# EAGLE design main (EAGLE 5.08)
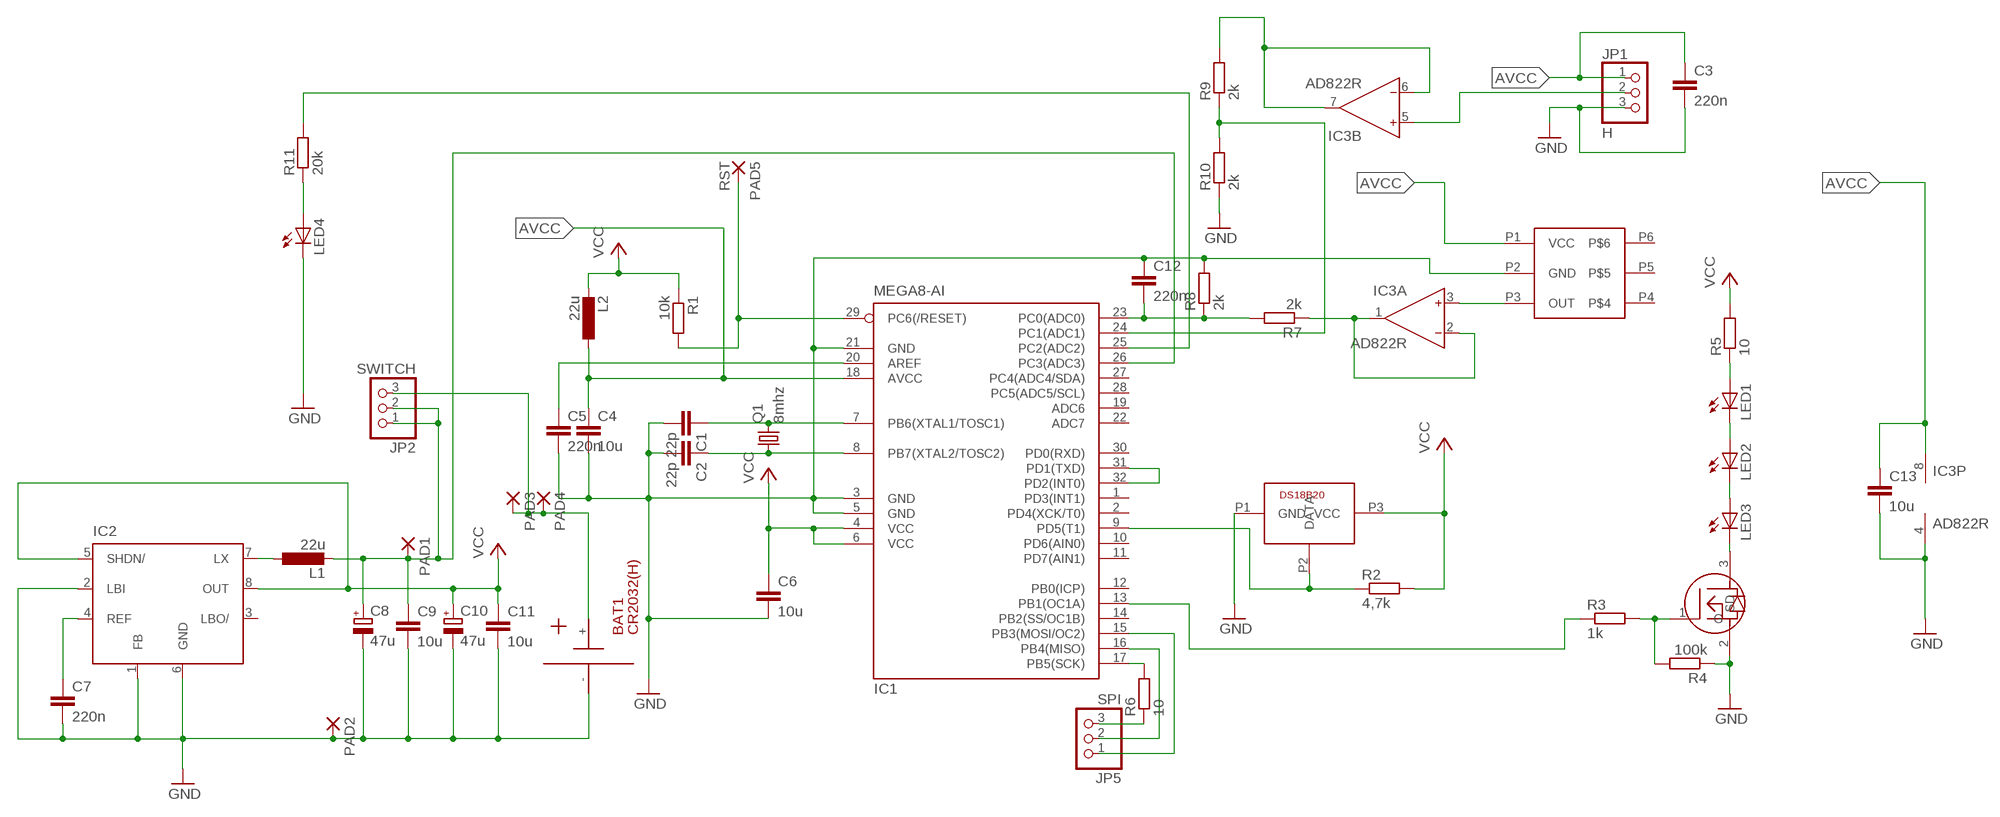
[diagram p0: schematic, sheet 1]

## Parts
BAT1  CR2032(H)  [BEL/P]
C1  22p  C-EUC0805  [C0805]
C2  22p  C-EUC0805  [C0805]
C3  220n  C-EUC1206  [C1206]
C4  10u  C-EUC0805  [C0805]
C5  220n  C-EUC0805  [C0805]
C6  10u  C-EUC0805  [C0805]
C7  220n  C-EUC0805  [C0805]
C8  47u  CPOL-EUE2.5-5  [E2,5-5]
C9  10u  C-EUC0805  [C0805]
C10  47u  CPOL-EUE2.5-5  [E2,5-5]
C11  10u  C-EUC0805  [C0805]
C12  220n  C-EUC0805  [C0805]
C13  10u  C-EUC0805  [C0805]
IC1  MEGA8-AI  [TQFP32-08]
IC2  MAX1674  [UMAX8]
IC3  AD822R  [SO8]
JP1  H  PINHD-1X3  [1X03]
JP2  SWITCH  PINHD-1X3  [1X03]
JP5  SPI  PINHD-1X3  [1X03]
L1  22u  L-EUL1812  [L1812]
L2  22u  L-EUL1812  [L1812]
LED1  LED5MM  [LED5MM]
LED2  LED5MM  [LED5MM]
LED3  LED5MM  [LED5MM]
LED4  LED5MM  [LED5MM]
PAD1  2,54/0,8  [2,54/0,8]
PAD2  2,54/0,8  [2,54/0,8]
PAD3  2,54/0,8  [2,54/0,8]
PAD4  2,54/0,8  [2,54/0,8]
PAD5  RST  2,54/0,8  [2,54/0,8]
Q1  8mhz  CRYSTALHC49S  [HC49/S]
R1  10k  R-EU_M1206  [M1206]
R2  4,7k  R-EU_M0805  [M0805]
R3  1k  R-EU_M1206  [M1206]
R4  100k  R-EU_M1206  [M1206]
R5  10  R-EU_M1206  [M1206]
R6  10  R-EU_M1206  [M1206]
R7  2k  R-EU_M1206  [M1206]
R8  2k  R-EU_M0805  [M0805]
R9  2k  R-EU_M1206  [M1206]
R10  2k  R-EU_M1206  [M1206]
R11  20k  R-EU_M0805  [M0805]
U$1  DS18B20  [TO-92]
U$2  IRLML2803  [MICRO3]
U$3  40PC  [40PC]

## Nets
AVCC: C3.1 C4.1 C13.1 IC1.18(AVCC) IC3.8(P:V+) JP1.1 L2.1 U$3.P1(VCC)
GND: BAT1.- C1.2 C2.2 C3.2 C4.2 C5.2 C6.2 C7.2 C8.- C9.2 C10.- C11.2 C12.1 C13.2 IC1.3(GND) IC1.5(GND) IC1.21(GND) IC2.1(FB) IC2.2(LBI) IC2.6(GND) IC3.4(P:V-) JP1.3 LED4.K(C) PAD2.1(P) R4.1 R8.2 R10.1 U$1.P1(GND) U$2.2(S) U$3.P2(GND)
N$1: C2.1 IC1.8(PB7(XTAL2/TOSC2)) Q1.1
N$2: C1.1 IC1.7(PB6(XTAL1/TOSC1)) Q1.2
N$3: IC3.1(A:OUT) IC3.2(A:IN-) R7.1
N$4: IC1.29(PC6(/RESET)) PAD5.1(P) R1.2
N$5: BAT1.+ JP2.3 PAD3.1(P) PAD4.1(P)
N$6: C12.2 IC1.23(PC0(ADC0)) R7.2 R8.1
N$7: IC3.6(B:IN-) IC3.7(B:OUT) R9.2
N$8: IC1.9(PD5(T1)) R2.1 U$1.P2(DATA)
N$9: IC1.31(PD1(TXD)) IC1.32(PD2(INT0))
N$10: C7.1 IC2.4(REF)
N$11: R3.2 R4.2 U$2.1(G)
N$12: LED2.K(C) LED3.A
N$13: LED1.K(C) LED2.A
N$14: IC2.7(LX) L1.1
N$15: LED3.K(C) U$2.3(D)
N$16: LED1.A R5.1
N$17: IC1.13(PB1(OC1A)) R3.1
N$18: JP5.3 R6.1
N$19: IC1.16(PB4(MISO)) JP5.2
N$20: IC1.17(PB5(SCK)) R6.2
N$21: IC1.15(PB3(MOSI/OC2)) JP5.1
N$22: C5.1 IC1.20(AREF)
N$23: IC3.3(A:IN+) U$3.P3(OUT)
N$24: IC3.5(B:IN+) JP1.2
N$25: IC1.24(PC1(ADC1)) R9.1 R10.2
N$26: LED4.A R11.1
N$27: IC1.25(PC2(ADC2)) R11.2
N$28: C8.+ C9.1 IC1.26(PC3(ADC3)) JP2.1 JP2.2 L1.2 PAD1.1(P)
VCC: C6.1 C10.+ C11.1 IC1.4(VCC) IC1.6(VCC) IC2.5(SHDN/) IC2.8(OUT) L2.2 R1.1 R2.2 R5.2 U$1.P3(VCC)
Unconnected: IC1.1(PD3(INT1)) IC1.2(PD4(XCK/T0)) IC1.10(PD6(AIN0)) IC1.11(PD7(AIN1)) IC1.12(PB0(ICP)) IC1.14(PB2(SS/OC1B)) IC1.19(ADC6) IC1.22(ADC7) IC1.27(PC4(ADC4/SDA)) IC1.28(PC5(ADC5/SCL)) IC1.30(PD0(RXD)) IC2.3(LBO/) U$3.P4 U$3.P5 U$3.P6

## Library data of the parts
BAT1 = connectors:CR2032
C1-C7 C9 C11-C13 = rcl:C-EU: CAPACITOR, European symbol
C8 C10 = rcl:CPOL-EU: POLARIZED CAPACITOR, European symbol
IC1 = atmel:MEGA8: MICROCONTROLLER 8 Kbytes FLASH, 1 kbytes SRAM, 512 bytes EEPROM, USART, 6-channel 10 bit ADC, 2-channel 8 bit ADC Pin compatible with Atmega48, ATMega88, ATMega168 Source: avr.lbr
IC2 = maxim:MAX1674: DC/DC CONVERTER
IC3 = analog-devices:AD822: Single-Supply, Rail-to-Rail Low Power FET-Input Op Amp Source: http://www.analog.com/static/imported-files/data_sheets/AD822.pdf
JP1 JP2 JP5 = pinhead:PINHD-1X3: PIN HEADER
L1 L2 = resistor:L-EU: INDUCTOR, European symbol
LED1-LED4 = led:LED: LED OSRAM: - CHIPLED LG R971, LG N971, LY N971, LG Q971, LY Q971, LO R971, LY R971 LH N974, LH R974 LS Q976, LO Q976, LY Q976 LO Q996 - Hyper CHIPLED LW Q18S LB Q993, LB Q99A, LB R99A - SideLED LS A670, LO A670, LY A670, LG A670, LP A670 LB A673, LV A673, LT A673, LW A673 LH A674 LY A675 LS A676, LA A676, LO A676, LY A676, LW A676 LS A679, LY A679, LG A679 - Hyper Micro SIDELED® LS Y876, LA Y876, LO Y876, LY Y876 LT Y87S - SmartLED LW L88C, LW L88S LB L89C, LB L89S, LG L890 LS L89K, LO L89K, LY L89K LS L896, LA L896, LO L896, LY L896 - TOPLED LS T670, LO T670, LY T670, LG T670, LP T670 LSG T670, LSP T670, LSY T670, LOP T670, LYG T670 LG T671, LOG T671, LSG T671 LB T673, LV T673, LT T673, LW T673 LH T674 LS T676, LA T676, LO T676, LY T676, LB T676, LH T676, LSB T676, LW T676 LB T67C, LV T67C, LT T67C, LS T67K, LO T67K, LY T67K, LW E67C LS E67B, LA E67B, LO E67B, LY E67B, LB E67C, LV E67C, LT E67C LW T67C LS T679, LY T679, LG T679 LS T770, LO T770, LY T770, LG T770, LP T770 LB T773, LV T773, LT T773, LW T773 LH T774 LS E675, LA E675, LY E675, LS T675 LS T776, LA T776, LO T776, LY T776, LB T776 LHGB T686 LT T68C, LB T68C - Hyper Mini TOPLED® LB M676 - Mini TOPLED Santana® LG M470 LS M47K, LO M47K, LY M47K Source: http://www.osram.convergy.de LUXEON: - LUMILED® LXK2-PW12-R00, LXK2-PW12-S00, LXK2-PW14-U00, LXK2-PW14-V00 LXK2-PM12-R00, LXK2-PM12-S00, LXK2-PM14-U00 LXK2-PE12-Q00, LXK2-PE12-R00, LXK2-PE12-S00, LXK2-PE14-T00, LXK2-PE14-U00 LXK2-PB12-K00, LXK2-PB12-L00, LXK2-PB12-M00, LXK2-PB14-N00, LXK2-PB14-P00, LXK2-PB14-Q00 LXK2-PR12-L00, LXK2-PR12-M00, LXK2-PR14-Q00, LXK2-PR14-R00 LXK2-PD12-Q00, LXK2-PD12-R00, LXK2-PD12-S00 LXK2-PH12-R00, LXK2-PH12-S00 LXK2-PL12-P00, LXK2-PL12-Q00, LXK2-PL12-R00 Source: www.luxeon.com KINGBRIGHT: KA-3528ASYC Source: www.kingbright.com
PAD1-PAD5 = wirepad:2,54/0,8: THROUGH-HOLE PAD
Q1 = crystal:CRYSTAL: CRYSTAL
R1-R11 = resistor:R-EU_: RESISTOR, European symbol
U$1 = DETECTORS:DS18B20
U$2 = transistor-power:IRLML2803
U$3 = DETECTORS:40PC

## Board
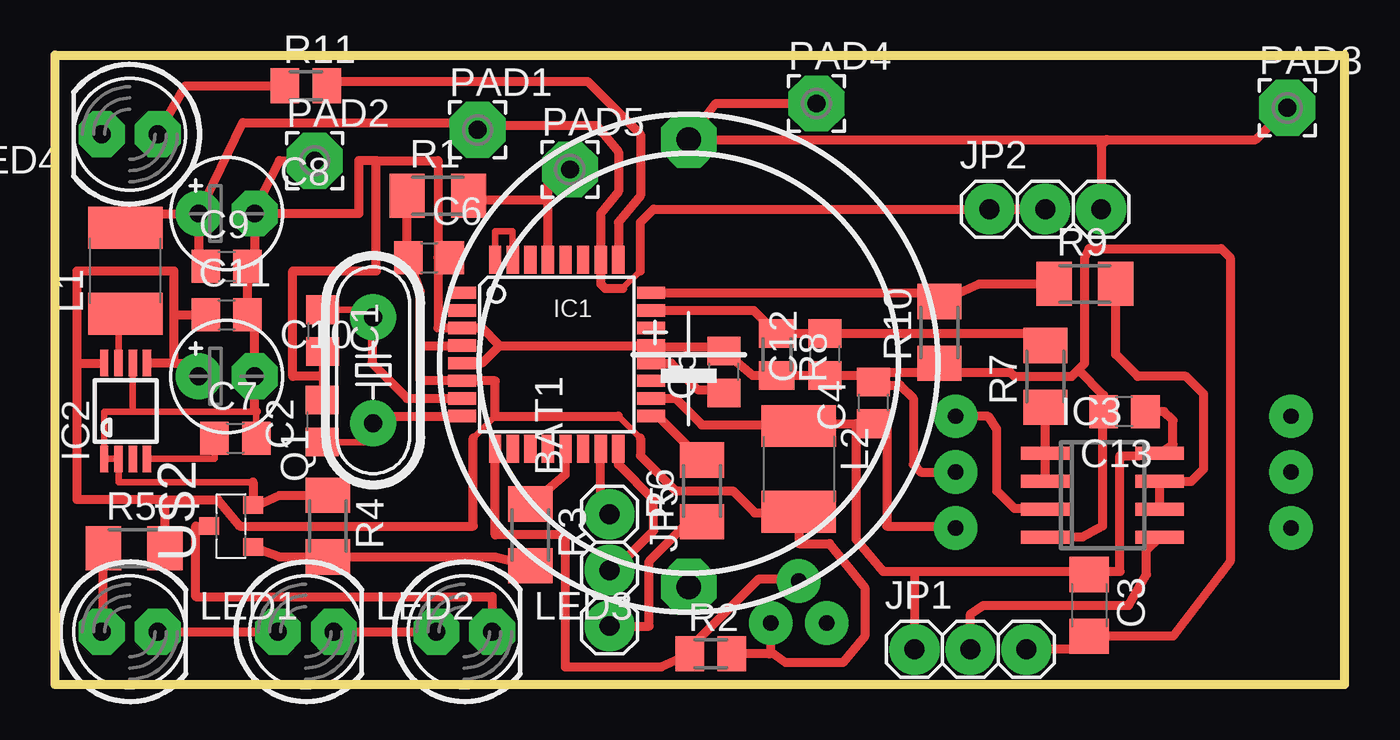
[diagram p1: board, top side]
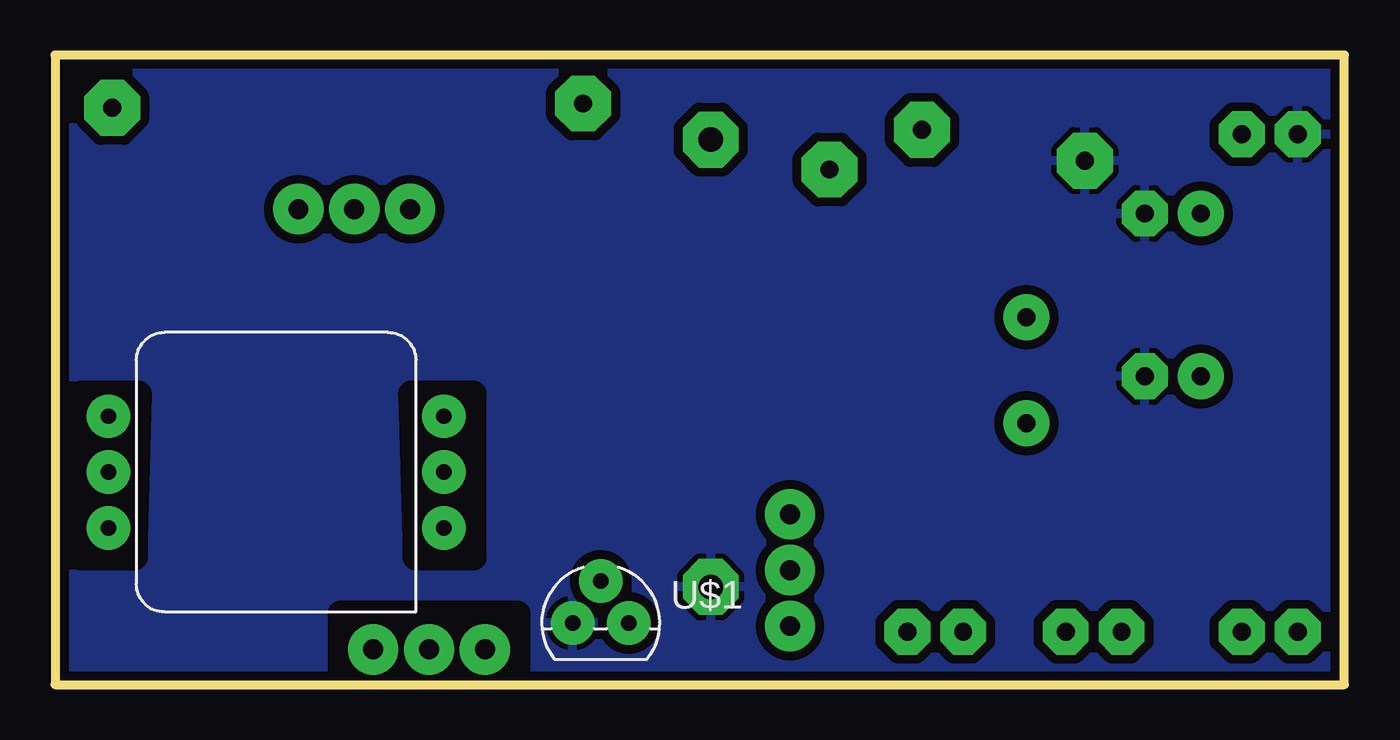
[diagram p2: board, bottom side, seen from below]

Size 58.6 x 28.6 mm. Coordinates in mm from the lower left corner, seen from the top.
Outline: 0,0 0,28.6 58.6,28.6 58.6,0 0,0
Copper layers (1*16): Top 0.035mm / dielectric 1.5mm / Bottom 0.035mm
Design rules "default *": minimum track width 0.02mm, minimum drill 0.3mm, track to track 0.25mm, track to pad 0.25mm, pad to pad 0.2mm, via to via 0.2mm, smd to smd 0.2mm, copper to edge 0.02mm, drill to drill 0.02mm, minimum pad ring 25mil, minimum via ring 12mil, stop-mask expansion 0mil, vias tented up to drill 0mil, thermal gap 10mil
bRestrict: area 39.6,5.8 to 42.4,13.2; area 54.8,5.8 to 57.4,13.2; area 37.6,0.2 to 45.6,3.2

### Footprints (pad centres in the part's own frame; a part is rotated, then mirrored left to right if it is on the bottom)
BEL/P = drill 1.118 pad 2.54 octagon: + 10.16,0; - -10.16,0
C0805 = smd 1.3 x 1.5: 1 -0.95,0; 2 0.95,0
C1206 = smd 1.6 x 1.8: 1 -1.4,0; 2 1.4,0
E2,5-5 = drill 0.813 pad 1.6 round: + -1.27,0 | drill 0.813 pad 1.6 octagon: - 1.27,0
TQFP32-08 = smd 1.27 x 0.559: 1 -4.293,2.8; 2 -4.293,2; 3 -4.293,1.2; 4 -4.293,0.4; 5 -4.293,-0.4; 6 -4.293,-1.2; 7 -4.293,-2; 8 -4.293,-2.8; 17 4.293,-2.8; 18 4.293,-2; 19 4.293,-1.2; 20 4.293,-0.4; 21 4.293,0.4; 22 4.293,1.2; 23 4.293,2; 24 4.293,2.8 | smd 0.559 x 1.27: 9 -2.8,-4.293; 10 -2,-4.293; 11 -1.2,-4.293; 12 -0.4,-4.293; 13 0.4,-4.293; 14 1.2,-4.293; 15 2,-4.293; 16 2.8,-4.293; 25 2.8,4.293; 26 2,4.293; 27 1.2,4.293; 28 0.4,4.293; 29 -0.4,4.293; 30 -1.2,4.293; 31 -2,4.293; 32 -2.8,4.293
UMAX8 = smd 0.381 x 1.2: 1 -0.975,-2.175; 2 -0.325,-2.175; 3 0.325,-2.175; 4 0.975,-2.175; 5 0.975,2.175; 6 0.325,2.175; 7 -0.325,2.175; 8 -0.975,2.175
SO8 = smd 0.6 x 2.2: 1 -1.905,-2.6; 2 -0.635,-2.6; 3 0.635,-2.6; 4 1.905,-2.6; 5 1.905,2.6; 6 0.635,2.6; 7 -0.635,2.6; 8 -1.905,2.6
1X03 = drill 0.9 pad 2.286 round: 1 -2.54,0; 2 0,0; 3 2.54,0
L1812 = smd 1.9 x 3.4: 1 -1.95,0; 2 1.95,0
LED5MM = drill 0.813 octagon: A -1.27,0; K 1.27,0
2,54/0,8 = drill 0.813 pad 2.54 octagon: 1 0,0
HC49/S = drill 0.813 round: 1 -2.413,0; 2 2.413,0
M1206 = smd 1.6 x 2: 1 -1.4,0; 2 1.4,0
M0805 = smd 1.3 x 1.6: 1 -0.95,0; 2 0.95,0
TO-92 = drill 0.7 round: P1 -1.27,0; P2 0,1.905; P3 1.27,0
MICRO3 = smd 0.8 x 0.9: 1 -0.95,-1; 2 0.95,-1; 3 0,1
40PC = drill 0.7 round: P1 3.81,-1.27; P2 6.35,-1.27; P3 8.89,-1.27; P4 8.89,13.97; P5 6.35,13.97; P6 3.81,13.97

### Placement (x,y rotation side)
BAT1  28.8,14.6 90 top
C1  12.17,16.08 270 top
C2  12.13,11.97 90 top
C3  47,3.6 270 top
C4  37.2,12.8 90 top
C5  30.4,14.2 90 top
C6  17,19.4 0 top
C7  8.2,11.2 0 top
C8  7.8,21.4 0 top
C9  7.8,19 0 top
C10  7.8,14 0 top
C11  7.8,16.8 0 top
C12  35,15 90 top
C13  48.6,12.4 180 top
IC1  22.8,15 0 top
IC2  3.21,12.43 0 top
IC3  47.6,8.6 270 top
JP1  41.6,1.6 0 top
JP2  45,21.6 0 top
JP5  25.2,5.2 270 top
L1  3.2,18.8 90 top
L2  33.8,9.8 270 top
LED1  3.4,2.4 0 top
LED2  11.4,2.4 0 top
LED3  18.6,2.4 0 top
LED4  3.4,25 180 top
PAD1  19.2,25.2 0 top
PAD2  11.8,23.8 0 top
PAD3  56,26.2 0 top
PAD4  34.6,26.4 0 top
PAD5  23.4,23.4 0 top
Q1  14.46,14.28 90 top
R1  17.4,22.2 0 top
R2  29.8,1.4 0 top
R3  21.6,6.8 270 top
R4  12.4,7.2 270 top
R5  3.6,6.2 0 top
R6  29.4,8.8 90 top
R7  45,14 90 top
R8  32.8,15 270 top
R9  46.8,18.2 0 top
R10  40.2,16 90 top
R11  11.4,27.2 0 top
U$1  33.8,2.8 0 bottom
U$2  8,7.2 90 top
U$3  42.2,3.3 90 bottom

### Tracks (layer width: path | path; a pad name or v marks a point on that pad's centre or on a via)
AVCC
  Top 0.406: C13.1 50.4,12.4 50.8,12 50.8,10.9 IC3.8 50.2,10.55 49.55,10.55 49.3,10.4 48.4,10.4 48.4,5.14 46.8,5.14 | 33.75,11.8 29.4,11.8 28.2,13 IC1.18 | 33.75,11.8 L2.1 34.15,11.4 | 33.75,11.8 33.8,11.85 36.4,11.85 | 36.4,11.85 C4.1 37.65,11.85 37.8,12 37.8,7.2 40.84,7.2 U$3.P1 | 36.4,11.85 36.4,6.6 37.63,5.14 39.2,5.14 | 39.2,5.14 46.8,5.14 | JP1.1 39.06,5 39.2,5.14 | C3.1 46.86,5.2 46.8,5.14
GND
  Top 0.305: IC1.5 18.28,14.6 | 3.54,12.4 IC2.6 | 3.54,12.4 9.15,12.4 C7.2 | C1.2 12.13,14.73 12.13,14 C2.2 | 3.54,12.4 2.23,12.4 IC2.1 IC2.2 2.88,9.2 9,9.2
  Top 0.406: 9,9.2 U$2.2 9.2,8.15 10.2,8.6 R4.1 | 17.4,19.4 17.4,16.2 IC1.3 19.4,16.2 20.2,15.4 | 17.4,19.4 C6.2 | 17.4,19.4 17.4,23.8 14.6,23.8 | 14.6,23.8 14.6,18.8 10.8,18.8 10.8,14 12.13,14 | IC1.5 19.4,14.6 20.2,15.4 | 9.15,18.6 C9.2 C11.2 9.07,16.48 C10.- 9.07,12.48 9.15,12.4 | IC3.4 46.7,6.7 47.6,7.2 47.6,12.25 C13.2 47.65,13.15 46.5,14.3 | C4.2 36.9,14.05 C12.1 R8.2 31.7,14.05 C5.2 30.2,15.35 27.14,15.35 IC1.21 20.2,15.4 | 40.2,14.2 37.4,14.2 37.2,14 C4.2 | 40.2,14.2 R10.1 | 8.8,19 9,19 9.07,19.07 C8.- 13.8,21.4 13.8,23.8 14.6,23.8 | U$3.P2 39.35,9.65 39,10 39,13 38.4,13.6 37.35,13.6 C4.2 | JP1.3 46.2,1.6 C3.2 50.8,2.2 53.4,5.6 53.4,19.4 53,19.8 47,19.8 46.8,19.4 46.8,14.6 46.5,14.3 | 9.2,21.4 9,21.6 9.2,21.8 10.2,23.8 PAD2.1 | 40.2,14.2 43.4,14.2 43.6,14 46.2,14 46.5,14.3
  pour Bottom (isolate 0.406, rank 2): 0,28.6 58.6,28.6 58.6,0 0,0
N$1
  Top 0.305: C2.1 14.46,11.02 Q1.1
  Top 0.406: IC1.8 14.79,12.2 Q1.1
N$2
  Top 0.305: C1.1 14.46,17.03 Q1.2
  Top 0.406: IC1.7 16,13 14.4,14.6 14.4,16.63 Q1.2
N$3
  Top 0.406: IC3.2 IC3.1 R7.1
N$4
  Top 0.406: IC1.29 22.4,22 | R1.2 19,22 22.4,22 | PAD5.1 22.4,23.4 22.4,22
N$5
  Top 0.406: 47.8,24.76 BAT1.+ 30.04,26.4 PAD4.1 | 47.8,24.76 54.56,24.76 PAD3.1 | JP2.3 47.54,24.5 47.8,24.76
N$6
  Top 0.406: IC1.23 31.75,17 R8.1 C12.2 44.65,15.95 R7.2
N$7
  Top 0.406: IC3.6 IC3.7 51.63,9.23 52.2,9.8 52.2,13.2 51.4,14 49.2,14 48.2,15 R9.2
N$8
  Top 0.406: U$1.P2 33.7,4.8 32,4.8 29,1.8 29,1.55 R2.1 27.55,0.8 23.2,0.8 23.2,6.8 20,6.8 IC1.9
N$9
  Top 0.305: IC1.32 20,20.6 20.8,20.6 IC1.31
N$10
  Top 0.305: IC2.4 7.25,10.26 C7.1
N$11
  Top 0.406: R3.2 20,5.8 R4.2 10.2,5.8 U$2.1
N$12
  Top 0.406: LED2.K LED3.A
N$13
  Top 0.406: LED1.K LED2.A
N$14
  Top 0.305: L1.1 2.88,16.65 IC2.7
N$15
  Top 0.406: LED3.K 19.87,4 6.4,4 6.4,7.2 U$2.3
N$16
  Top 0.406: R5.1 2.2,2.47 LED1.A
N$17
  Top 0.406: 21.4,8 R3.1 23.2,9.55 IC1.13
N$18
  Top 0.406: JP5.3 27,2.66 27,5.6 29,7.6 29.2,7.6 R6.1
N$19
  Top 0.406: JP5.2 25.4,5.2 27.2,7 27.2,8.4 25.6,10 IC1.16
N$20
  Top 0.406: IC1.17 27.4,12.2 R6.2
N$21
  Top 0.406: IC1.15 24.8,8.14 JP5.1
N$22
  Top 0.406: IC1.20 28,14.6 29.2,13.4 30.35,13.4 C5.1
N$23
  Top 0.406: U$3.P3 42.41,12.19 42.8,11.6 42.8,8.8 43.6,8 44.97,8 IC3.3
N$24
  Top 0.406: JP1.2 41.6,3.2 42.2,3.6 48.8,3.6 49.6,5 49.6,6.09 IC3.5
N$25
  Top 0.406: IC1.24 40.2,17.8 R10.2 42,18.2 R9.1
N$26
  Top 0.406: R11.1 5.93,27.2 LED4.A
N$27
  Top 0.406: IC1.25 25.6,21 26.6,22.2 26.6,25 24.2,27.4 12.55,27.4 R11.2
N$28
  Top 0.305: 25.8,18 26.6,18.8
  Top 0.406: C8.+ 3.85,21.4 L1.2 | C8.+ 6.53,19.32 C9.1 | C8.+ 8.53,25.53 18.87,25.53 PAD1.1 19.4,25.4 24.6,25.4 25.6,24.2 25.6,22.4 24.8,21.4 IC1.26 24.8,18.2 25,18 25.8,18 | JP2.1 JP2.2 27.2,21.6 26.6,21 26.6,18.8
VCC
  Top 0.305: R1.1 16.16,22.45 | IC1.6 19.07,13.73 | R1.1 16.4,22.09 | R1.1 16,22.4 | 19,11.2 20,12.2 | 25.6,12.2 26.6,11.2
  Top 0.406: 5.4,14.61 IC2.5 | 5.4,16.8 5.4,18.8 1,18.8 1,14.6 | 5.4,16.8 5.4,14.61 | 1,14.6 1,8.4 4.8,8.4 | 1,14.6 IC2.8 | 4.8,8.4 7.4,8.4 8.4,7.2 19,7.2 19,11.2 | R1.1 16,19.4 C6.1 16.6,17.85 16.6,15.4 | 16.6,15.4 IC1.4 | 16.6,15.4 16.6,13.8 IC1.6 20,13.8 20,12.2 25.6,12.2 | 26.6,11.2 26.6,10.4 28.2,8.8 30.8,8.8 31.8,7.8 33.75,7.8 L2.2 | R5.2 5,8.2 4.8,8.4 | 32.53,1.47 U$1.P3 | 32.53,1.47 33.2,1 35.8,1 36.8,2.2 36.8,4.4 35.2,6.4 33.8,6.4 L2.2 | L2.2 33.85,7.8 | 5.4,14.61 5.92,14.61 C10.+ | 5.4,16.8 C11.1 | R2.2 32.46,1.4 32.53,1.47